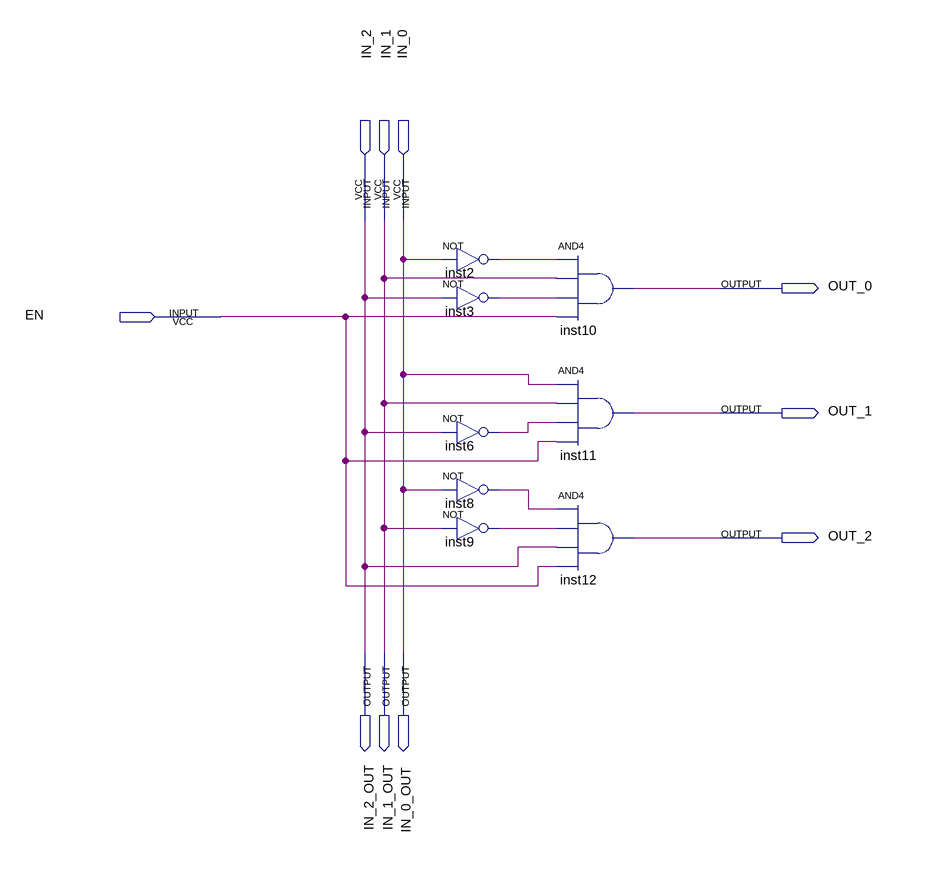
[diagram p0: schematic sheet]
// Quartus schematic DEMUX_3bits_3.bdf as structural Verilog: 8 symbols, 10 pins
module DEMUX_3bits_3 (
  input  IN_2,
  input  IN_1,
  input  IN_0,
  input  EN,
  output OUT_0,
  output OUT_1,
  output OUT_2,
  output IN_2_OUT,
  output IN_1_OUT,
  output IN_0_OUT
);

  wire inst2_out, inst3_out, inst6_out, inst8_out, inst9_out;

  not inst2 (inst2_out, IN_0);
  not inst3 (inst3_out, IN_2);
  not inst6 (inst6_out, IN_2);
  not inst8 (inst8_out, IN_0);
  not inst9 (inst9_out, IN_1);
  and inst10 (OUT_0, inst2_out, IN_1, inst3_out, EN);
  and inst11 (OUT_1, IN_0, IN_1, inst6_out, EN);
  and inst12 (OUT_2, inst8_out, inst9_out, IN_2, EN);

  assign IN_0_OUT = IN_0;
  assign IN_1_OUT = IN_1;
  assign IN_2_OUT = IN_2;
endmodule
